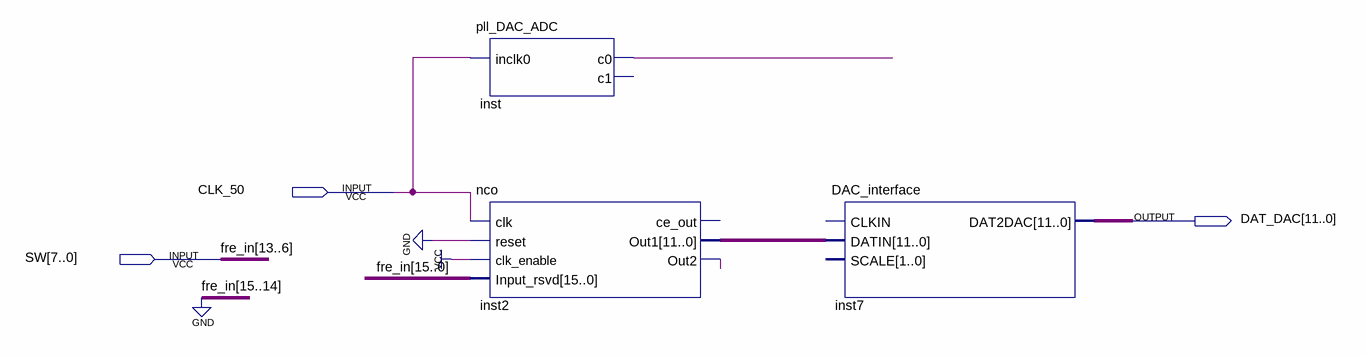
[diagram p0: schematic sheet]
// Quartus schematic nco_quartus.bdf as structural Verilog: 3 symbols, 3 pins
module nco_quartus (
  input  CLK_50,
  input  [7:0] SW,
  output [11:0] DAT_DAC
);

  wire inst2_out2, inst_c0;
  wire [5:0] fre_in;
  wire [11:0] inst2_out1;

  pll_DAC_ADC inst (.inclk0(CLK_50), .c0(inst_c0));  // open: c1
  nco inst2 (
    .clk(CLK_50), .reset(1'b0), .clk_enable(1'b1), .Input_rsvd({2'b00, SW, fre_in}), .Out1(inst2_out1),
    .Out2(inst2_out2));  // open: ce_out
  DAC_interface inst7 (.DATIN(inst2_out1), .DAT2DAC(DAT_DAC));  // open: CLKIN, SCALE

  // Other names for the same wires on the sheet: fre_in[13:6] = SW
endmodule
